# EAGLE design core_3 (EAGLE 6.6.0)
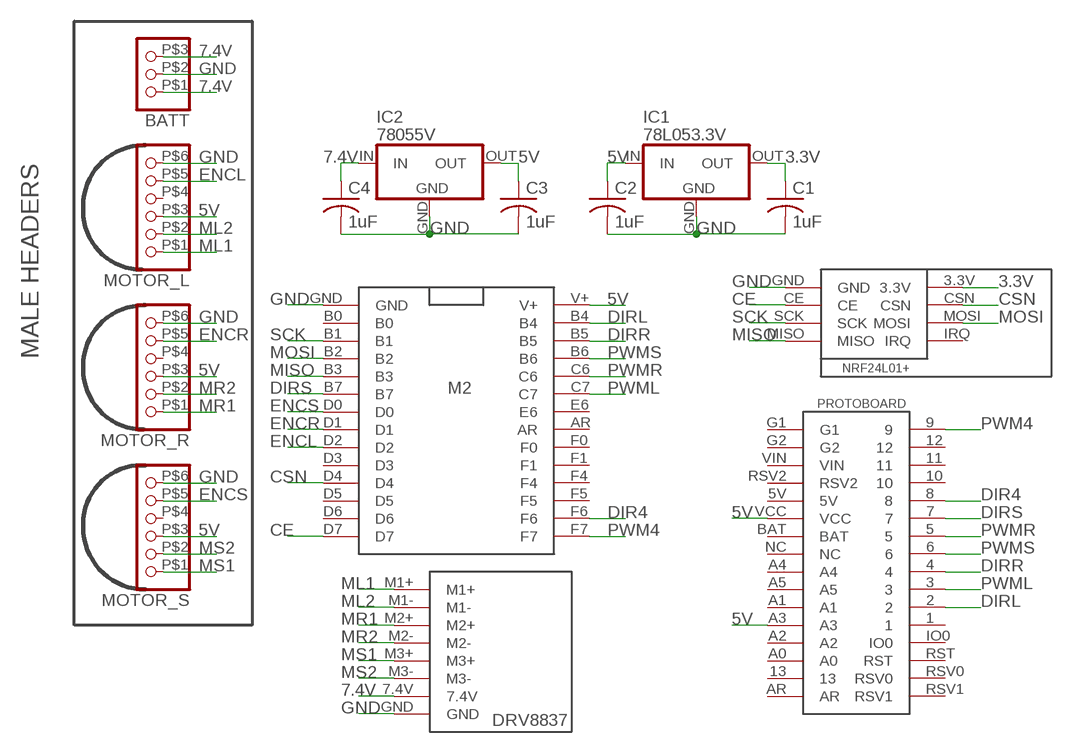
[diagram p0: schematic, sheet 1]

## Parts
BATT  PINHD-1X3SMD  [1X3/90SMD]
C1  1uF  C-US025-030X050  [C025-030X050]
C2  1uF  C-US025-030X050  [C025-030X050]
C3  1uF  C-US025-030X050  [C025-030X050]
C4  1uF  C-US025-030X050  [C025-030X050]
IC1  78L053.3V  [TO92]
IC2  78055V  [TO220H]
MOTOR_L  PINHD-1X6SMD  [1X6/90SMD]
MOTOR_R  PINHD-1X6SMD  [1X6/90SMD]
MOTOR_S  PINHD-1X6SMD  [1X6/90SMD]
U$1  NRF24L01  [NRF24L01]
U$2  M2  [M2]
U$3  PROTOBOARDSMD  [PROTOSMD]
U$4  DRV8837  [DRV8837]

## Nets
3.3V: C1.1 IC1.OUT U$1.3.3V
5V: C2.1 C3.1 IC1.IN IC2.OUT MOTOR_L.P$3 MOTOR_R.P$3 MOTOR_S.P$3 U$2.V+ U$3.A3 U$3.VCC
7.4V: BATT.P$1 BATT.P$3 C4.1 IC2.IN U$4.7.4V
CE: U$1.CE U$2.D7
CSN: U$1.CSN U$2.D4
DIR4: U$2.F6 U$3.8
DIRL: U$2.B4 U$3.2
DIRR: U$2.B5 U$3.4
DIRS: U$2.B7 U$3.7
ENCL: MOTOR_L.P$5 U$2.D2
ENCR: MOTOR_R.P$5 U$2.D1
ENCS: MOTOR_S.P$5 U$2.D0
GND: BATT.P$2 C1.2 C2.2 C3.2 C4.2 IC1.GND IC2.GND MOTOR_L.P$6 MOTOR_R.P$6 MOTOR_S.P$6 U$1.GND U$2.GND U$4.GND
MISO: U$1.MISO U$2.B3
ML1: MOTOR_L.P$1 U$4.M1+
ML2: MOTOR_L.P$2 U$4.M1-
MOSI: U$1.MOSI U$2.B2
MR1: MOTOR_R.P$1 U$4.M2+
MR2: MOTOR_R.P$2 U$4.M2-
MS1: MOTOR_S.P$1 U$4.M3+
MS2: MOTOR_S.P$2 U$4.M3-
PWM4: U$2.F7 U$3.9
PWML: U$2.C7 U$3.3
PWMR: U$2.C6 U$3.5
PWMS: U$2.B6 U$3.6
SCK: U$1.SCK U$2.B1
Unconnected: MOTOR_L.P$4 MOTOR_R.P$4 MOTOR_S.P$4 U$1.IRQ U$2.AR U$2.B0 U$2.D3 U$2.D5 U$2.D6 U$2.E6 U$2.F0 U$2.F1 U$2.F4 U$2.F5 U$3.1 U$3.5V U$3.10 U$3.11 U$3.12 U$3.13 U$3.A0 U$3.A1 U$3.A2 U$3.A4 U$3.A5 U$3.AR U$3.BAT U$3.G1 U$3.G2 U$3.IO0 U$3.NC U$3.RST U$3.RSV0 U$3.RSV1 U$3.RSV2 U$3.VIN

## Notes on the sheet
- MALE HEADERS

## Library data of the parts
BATT = apro:PINHD-1X3: PIN HEADER
C1-C4 = rcl:C-US: CAPACITOR, American symbol
IC1 IC2 = apro:78*: Positive VOLTAGE REGULATOR Source: http://cache.national.com/ds/LM/LM78L05.pdf http://www.fairchildsemi.com/ds/LM/LM7805.pdf
MOTOR_L MOTOR_R MOTOR_S = apro:PINHD-1X6: PIN HEADER
U$1 = apro:NRF24L01
U$2 = M2:M2
U$3 = apro:PROTOBOARD
U$4 = apro:DRV8837

## Board
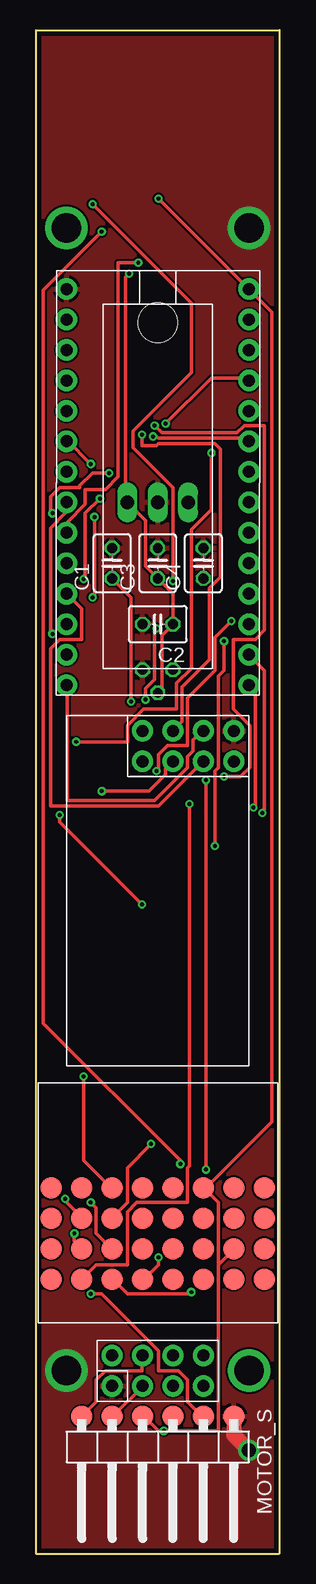
[diagram p1: board, top side]
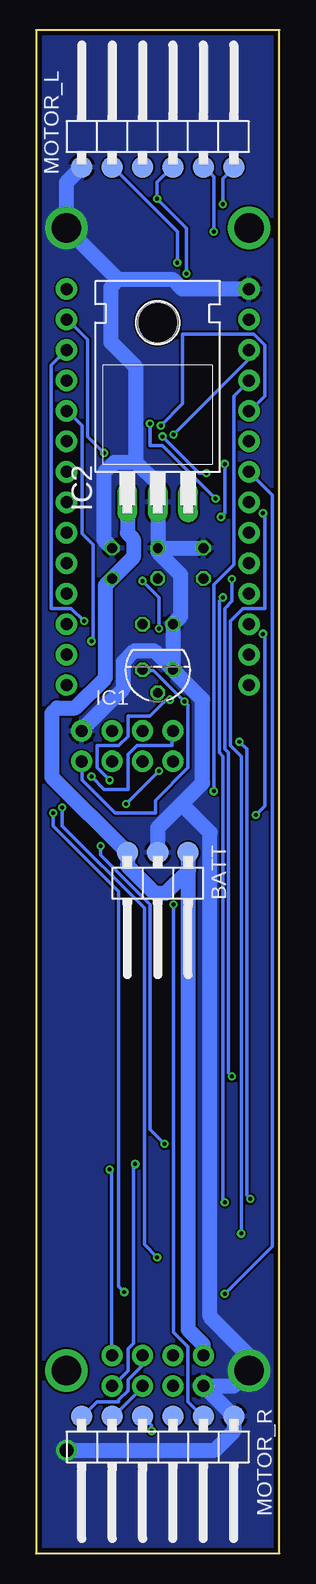
[diagram p2: board, bottom side, seen from below]

Size 20.32 x 127 mm. Coordinates in mm from the lower left corner, seen from the top.
Outline: 0,0 20.32,0 20.32,127 0,127 0,0
Copper layers (1*16): Top 0.0356mm / dielectric 1.5011mm / Bottom 0.0356mm
Design rules "LaenPCBOrder *": minimum track width 12mil, minimum drill 13mil, track to track 6mil, track to pad 6mil, pad to pad 6mil, via to via 6mil, smd to smd 6mil, copper to edge 15mil, drill to drill 6mil, minimum pad ring 7mil, minimum via ring 7mil, stop-mask expansion 3mil, vias tented up to drill 0mil, thermal gap 10mil

### Footprints (pad centres in the part's own frame; a part is rotated, then mirrored left to right if it is on the bottom)
1X3/90SMD = smd 1.778 x 1.778: P$1 -2.54,-2.54; P$2 0,-2.54; P$3 2.54,-2.54
C025-030X050 = drill 0.813 octagon: 1 -1.27,0; 2 1.27,0
TO92 = drill 0.813 octagon: GND -1.27,0; IN 0,1.905; OUT 1.27,0
TO220H = drill 1.118 long: GND 0,-10.16; IN -2.54,-10.16; OUT 2.54,-10.16 | hole 3.302: 0,4.826
1X6/90SMD = smd 1.778 x 1.778: P$1 6.35,-2.54; P$2 3.81,-2.54; P$3 1.27,-2.54; P$4 -1.27,-2.54; P$5 -3.81,-2.54; P$6 -6.35,-2.54
NRF24L01 = drill 1 pad 1.778: 3.3V 1.27,3.81; CE -1.27,1.27; CSN 1.27,1.27; GND -1.27,3.81; IRQ 1.27,-3.81; MISO -1.27,-3.81; MOSI 1.27,-1.27; SCK -1.27,-1.27
M2 = drill 1 pad 1.778: AR 0,-17.78; B0 -15.24,-2.54; B1 -15.24,-5.08; B2 -15.24,-7.62; B3 -15.24,-10.16; B4 0,-2.54; B5 0,-5.08; B6 0,-7.62; B7 -15.24,-12.7; C6 0,-10.16; C7 0,-12.7; D0 -15.24,-15.24; D1 -15.24,-17.78; D2 -15.24,-20.32; D3 -15.24,-22.86; D4 -15.24,-25.4; D5 -15.24,-27.94; D6 -15.24,-30.48; D7 -15.24,-33.02; E6 0,-15.24; F0 0,-20.32; F1 0,-22.86; F4 0,-25.4; F5 0,-27.94; F6 0,-30.48; F7 0,-33.02; GND -15.24,0; V+ 0,0
PROTOSMD = smd 1.778 x 1.778: 1 6.35,-1.27; 2 6.35,1.27; 3 6.35,3.81; 4 6.35,6.35; 5 3.81,1.27; 5V -6.35,6.35; 6 3.81,-1.27; 7 3.81,3.81; 8 3.81,6.35; 9 1.27,6.35; 10 1.27,-1.27; 11 1.27,1.27; 12 1.27,3.81; 13 -1.27,1.27; A0 -1.27,3.81; A1 -3.81,1.27; A2 -1.27,6.35; A3 -3.81,-1.27; A4 -3.81,6.35; A5 -3.81,3.81; AR -1.27,-1.27; BAT -6.35,1.27; G1 -8.89,6.35; G2 -8.89,3.81; IO0 8.89,6.35; NC -6.35,-1.27; RST 8.89,3.81; RSV0 8.89,1.27; RSV1 8.89,-1.27; RSV2 -8.89,-1.27; VCC -6.35,3.81; VIN -8.89,1.27
DRV8837 = drill 1 pad 1.778: 7.4V -1.27,-3.81; GND 1.27,-3.81; M1+ -1.27,3.81; M1- 1.27,3.81; M2+ -1.27,1.27; M2- 1.27,1.27; M3+ -1.27,-1.27; M3- 1.27,-1.27

### Placement (x,y rotation side)
BATT  10.16,55.88 180 bottom
C1  6.35,82.55 90 top
C2  10.16,77.47 180 top
C3  10.16,82.55 90 top
C4  13.97,82.55 90 top
IC1  10.16,73.66 180 bottom
IC2  10.16,97.79 0 bottom
MOTOR_L  10.16,118.11 0 bottom
MOTOR_R  10.16,8.89 180 bottom
MOTOR_S  10.16,8.89 180 top
U$1  12.7,67.31 270 top
U$2  17.78,105.41 0 top
U$3  10.16,29.21 180 top
U$4  10.16,15.24 270 top

### Tracks (layer width: path | path; a pad name or v marks a point on that pad's centre or on a via)
3.3V  (via drill 0.33)
  Top 0.305: C1.1 7.92,79.7 v7.92,71.02
  Bottom 0.305: IC1.OUT 11.43,73.61 10.52,73.61 v7.92,71.02 7.62,70.71 7.62,65.53 10.36,62.79 10.36,61.72 13.72,61.72 16.46,64.47 16.46,65.99 U$1.3.3V
5V  (via drill 0.33)
  Top 0.305: 15.32,24.16 16.46,25.3 U$3.VCC | 15.32,24.16 15.24,24.08 15.24,10.21 v10.67,10.21 10.21,10.21 8.99,11.43 MOTOR_S.P$3 | 15.32,24.16 15.24,24.23 15.24,29.26 14.02,30.48 U$3.A3 14.17,30.48 19.66,35.97 19.66,103.48 17.83,105.31 U$2.V+ 17.68,105.46 v10.21,112.93 | IC1.IN 10.21,71.78 10.52,72.08 10.52,76.5 11.43,77.42 C2.1 11.43,80.01 C3.1 9.14,82.3 9.14,86.11 IC2.OUT 7.47,87.78 7.47,106.38 v7.77,106.68
  Top 0.406: U$2.V+ 17.75,105.39
  Bottom 0.305: MOTOR_R.P$3 10.67,10.67 v10.67,10.21 | MOTOR_L.P$3 8.99,115.52 10.21,114.3 v10.21,112.93 7.77,110.49 v7.77,106.68
7.4V
  Bottom 1.27: IC2.IN 12.7,85.06 12.19,84.56 12.19,83.06 C4.1 14.53,80.72 14.53,73 17.04,70.48 18.57,70.48 19,70.05 19,64.72 BATT.P$3 12.7,57.33 10.41,55.04 9.5,55.04 7.59,56.95 7.59,58.4 BATT.P$1 7.62,18.67 6.38,17.42 6.38,16.54 U$4.7.4V
CE
  Top 0.305: U$1.CE 13.87,68.58 13.11,67.82 13.11,66.9 12.65,66.45 12.65,65.53 9.91,62.79 2.59,62.79 2.59,72.39 U$2.D7
CSN
  Top 0.305: U$1.CSN 13.87,65.99 10.21,62.33 1.22,62.33 1.22,75.44 1.98,76.2 3.81,76.2 3.81,78.79 2.59,80.01 U$2.D4
DIR4  (via drill 0.33)
  Top 0.305: v12.95,21.79 12.95,21.64 7.62,21.64 6.4,22.86 U$3.8 | v18.9,61.72 19.05,61.87 19.05,73.61 17.83,74.83 U$2.F6
  Bottom 0.305: v12.95,21.79 13.41,22.25 13.41,55.17 18.9,60.66 v18.9,61.72
DIRL  (via drill 0.33)
  Top 0.305: v2.44,29.57 2.44,29.41 3.81,28.04 U$3.2 | v3.35,67.67 7.62,67.67 7.62,69.04 8.99,70.41 11.73,70.41 11.73,72.54 12.95,73.76 12.95,85.34 14.63,87.02 v14.63,91.75
  Bottom 0.305: v2.44,29.57 2.74,29.87 2.74,67.06 v3.35,67.67 | v14.63,91.75 16,93.12 16,101.19 17.68,102.87 U$2.B4
DIRR  (via drill 0.33)
  Top 0.305: U$3.4 5.03,24.08 7.62,24.08 7.62,28.5 8.38,29.26 12.65,29.26 12.65,32.16 12.8,32.31 v12.8,62.48 | v10.06,65.23 10.21,65.38 10.21,66.6 10.97,67.36 12.65,67.36 12.65,71.32 14.94,73.61 14.94,76.35 v16.31,77.72
  Bottom 0.305: v10.06,65.23 v12.8,62.48 | v16.31,77.72 17.37,78.79 19.05,78.79 19.05,99.06 U$2.B5
DIRS  (via drill 0.33)
  Top 0.305: v4.57,29.26 5.03,28.8 5.03,26.67 6.25,25.45 U$3.7 | v4.72,79.7 4.88,79.86 v4.88,86.41 | v4.57,90.83 2.59,92.81 U$2.B7
  Bottom 0.305: v4.57,29.26 4.72,29.41 4.72,66.45 5.03,66.75 5.03,79.4 v4.72,79.7 | v4.88,86.41 4.57,86.72 v4.57,90.83
ENCL  (via drill 0.33)
  Top 0.305: v8.53,107.59 6.86,107.59 6.86,89.76 5.79,88.7 4.12,88.7 4.12,87.48 2.59,85.95 2.59,85.19 U$2.D2
  Bottom 0.305: v8.53,107.59 8.53,110.19 13.87,115.52 MOTOR_L.P$5
ENCR  (via drill 0.33)
  Top 0.305: v8.84,54.1 1.98,60.96 v1.98,61.57 | v1.37,76.66 1.22,76.81 1.22,85.5 2.44,86.72 2.44,87.63 U$2.D1
  Bottom 0.305: v8.84,54.1 8.84,18.44 7.62,17.22 7.62,12.65 6.4,11.43 MOTOR_R.P$5 | v1.98,61.57 1.22,62.33 1.22,76.5 v1.37,76.66
ENCS  (via drill 0.33)
  Top 0.305: v4.57,21.64 5.49,21.64 10.21,16.92 10.21,15.24 11.89,15.24 12.65,14.48 12.65,12.65 13.87,11.43 MOTOR_S.P$5
  Bottom 0.305: v4.57,21.64 0.61,25.6 0.61,88.24 U$2.D0
GND  (via drill 1.17 pad 1.52, 2.44 pad 3.56)
  Top 1.27: MOTOR_S.P$6 16.51,9.86 v17.75,8.61
  Bottom 1.27: 11.99,90.96 10.16,89.13 IC2.GND C3.2 | 11.99,90.96 13.77,90.96 14.68,90.04 14.68,84.53 C4.2 | C3.2 C1.2 | C3.2 10.16,83.49 8.26,81.58 8.26,78.11 C2.2 IC1.GND | U$1.GND 16.51,68.66 14.02,71.14 13.99,71.14 13.03,72.11 13.03,74.32 12.09,75.26 10.49,75.26 IC1.GND | BATT.P$2 10.16,60.5 8.17,62.5 | 8.17,62.5 6.43,64.24 6.43,71.2 IC1.GND | v17.75,8.61 5.41,8.61 3.79,10.24 3.79,11.4 MOTOR_R.P$6 U$4.GND 3.81,13.97 v2.54,15.24 2.54,16.48 5.79,19.74 5.79,60.12 8.17,62.5 | U$2.GND 8.1,105.41 8.87,106.17 13.46,106.17 | 13.46,106.17 v17.78,110.49 17.78,114.3 MOTOR_L.P$6 | 11.99,90.96 11.99,98.88 14.07,100.97 14.07,105.56 13.46,106.17
  pour Bottom: -2.54,129.54 -2.54,-2.54 22.86,-2.54 22.86,129.54
  pour Top: -2.54,129.54 22.86,129.54 22.86,-2.54 -2.54,-2.54
MISO  (via drill 0.33)
  Top 0.305: v9.91,94.03 10.52,93.42 16.76,93.42 17.37,94.03 19.05,94.03 19.05,76.96 18.29,76.2 16.46,76.2 16.46,70.41 17.83,69.04 17.83,65.53 17.07,64.77 v15.7,64.77
  Bottom 0.305: v9.91,94.03 8.08,95.86 8.08,101.65 2.13,101.65 1.22,100.74 1.22,96.47 2.44,95.25 U$2.B3 | v15.7,64.77 14.63,63.7 12.65,63.7 12.65,66.6 11.89,67.36 8.99,67.36 8.99,68.58 U$1.MISO
ML1  (via drill 0.33)
  Top 0.305: v4.72,112.47 12.95,104.24 12.95,98.45 8.08,93.57 8.08,92.2 11.43,88.85 v11.43,81.08 | v10.06,77.11 9.91,76.96 9.91,72.85 9.14,72.08 v9.14,71.17 | v14.17,32 v14.17,64.47
  Bottom 0.305: v4.72,112.47 4.72,114.61 3.81,115.52 MOTOR_L.P$1 | v11.43,81.08 10.06,79.7 v10.06,77.11 | v9.14,71.17 9.45,71.17 10.82,69.8 12.65,69.8 12.65,68.12 13.41,67.36 15.24,67.36 15.24,65.53 v14.17,64.47 | v14.17,32 14.02,31.85 14.02,16.61 U$4.M1+
ML2  (via drill 0.33)
  Top 0.305: v5.49,110.19 0.61,105.31 0.61,44.2 12.04,32.77 v12.04,32.46
  Bottom 0.305: v5.49,110.19 5.49,114.76 6.25,115.52 MOTOR_L.P$2 | v12.04,32.46 12.19,32.31 12.19,17.53 12.65,17.07 12.65,15.24 13.87,14.02 U$4.M1-
MOSI  (via drill 0.33)
  Top 0.305: v5.49,63.55 9.45,63.55 10.82,64.92 10.82,65.38 11.43,65.99 U$1.MOSI
  Bottom 0.305: v5.49,63.55 5.49,80.77 3.81,82.45 3.81,96.47 2.59,97.69 U$2.B2
MR1
  Bottom 0.305: U$4.M2+ 11.43,15.7 12.65,14.48 12.65,13.56 13.41,12.8 13.41,12.65 15.24,12.65 16.46,11.43 MOTOR_R.P$1
MR2
  Bottom 0.305: MOTOR_R.P$2 13.87,11.43 11.43,13.87 U$4.M2-
MS1
  Top 0.305: MOTOR_S.P$1 5.03,12.65 5.03,14.48 5.79,15.24 8.84,15.24 8.84,16.46 U$4.M3+
MS2
  Top 0.305: MOTOR_S.P$2 6.4,11.43 8.84,13.87 U$4.M3-
N$2  (via drill 2.44 pad 3.56)
  other vias: 17.78,15.24
N$3  (via drill 2.44 pad 3.56)
  other vias: 2.54,110.49
PWM4  (via drill 0.33)
  Top 0.305: v10.21,24.69 10.21,24.08 8.99,22.86 U$3.9 | v18.14,62.18 18.29,62.33 18.29,71.93 17.83,72.39 U$2.F7
  Bottom 0.305: v10.21,24.69 11.28,25.76 11.28,53.8 18.14,60.66 v18.14,62.18
PWML  (via drill 0.33)
  Top 0.305: v3.2,26.67 3.2,26.06 3.81,25.45 U$3.3 | v1.37,86.72 1.22,86.87 1.22,88.09 1.98,88.85 3.66,88.85 3.66,89 4.72,90.07 v6.1,90.07 | v9.75,93.12 10.06,93.12 10.21,92.96 17.68,92.96 17.68,92.81 U$2.C7
  Bottom 0.305: v3.2,26.67 3.2,66.45 4.12,67.36 4.12,77.72 3.05,78.79 1.22,78.79 1.22,86.56 v1.37,86.72 | v6.1,90.07 6.71,90.07 v9.75,93.12
PWMR  (via drill 0.33)
  Top 0.305: v9.6,34.14 7.62,32.16 7.62,29.26 6.4,28.04 U$3.5 | v14.94,58.98 14.94,65.23 15.24,65.53 15.24,73.15 15.7,73.61 v15.7,76.05
  Bottom 0.305: v9.6,34.14 10.82,35.36 10.82,54.1 14.94,58.22 v14.94,58.98 | v15.7,76.05 15.54,76.2 15.54,84.12 16.46,85.04 16.46,94.03 17.68,95.25 U$2.C6
PWMS  (via drill 0.33)
  Top 0.305: v3.96,39.78 3.96,32.77 6.25,30.48 U$3.6 | v3.96,81.23 4.12,81.38 4.12,86.72 v5.33,87.94 | v10.82,94.18 14.63,97.99 17.68,97.99 17.68,97.84 U$2.B6
  Bottom 0.305: v3.96,39.78 4.27,40.08 4.27,66.75 4.57,67.06 4.57,78.79 3.96,79.4 v3.96,81.23 | v5.33,87.94 9.75,92.35 10.82,92.35 v10.82,94.18
SCK  (via drill 0.33)
  Top 0.305: U$1.SCK 12.19,69.34 12.19,72.24 14.48,74.52 14.48,80.47 15.39,81.38 15.39,92.05 14.94,92.51 10.21,92.51 10.06,92.35 8.84,92.35 v8.84,93.27
  Bottom 0.305: v8.84,93.27 2.59,99.52 2.59,100.28 U$2.B1